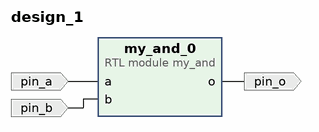
[diagram p0: block diagram of the top level]
# Vivado block design design_1, xc7z020clg400-1, Vivado 2023.2
create_bd_design design_1

create_bd_port -dir I pin_a
create_bd_port -dir I pin_b
create_bd_port -dir O pin_o

create_bd_cell -type module -reference my_and my_and_0

# ---- connections ----

connect_bd_net -net a_0_1 [get_bd_ports pin_a] [get_bd_pins my_and_0/a]
connect_bd_net -net b_0_1 [get_bd_ports pin_b] [get_bd_pins my_and_0/b]
connect_bd_net [get_bd_pins my_and_0/o] [get_bd_ports pin_o]

validate_bd_design
save_bd_design
